# Altium project NTAG I2C plus Class4 Antenna v1.PrjPcb
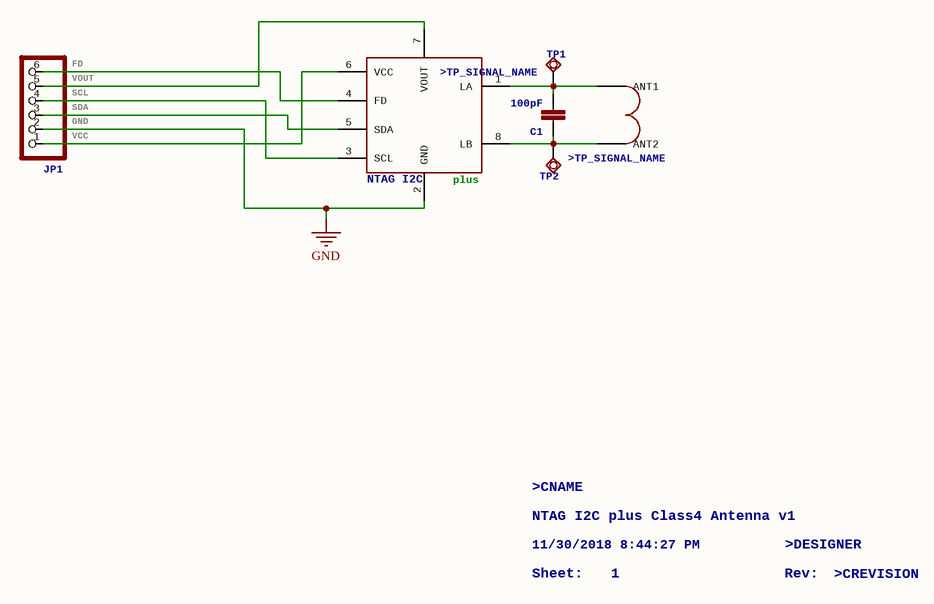
[diagram p0: NTAG I2C plus Class4 Antenna v1.SchDoc]
1 sheet, 6 parts. Net scope: global (net labels, ports and power ports of the same name join across sheets).
Board file: NTAG I2C plus Class4 Antenna v1.PcbDoc

## Sheet NTAG I2C plus Class4 Antenna v1.SchDoc: NTAG I2C plus Class4 Antenna v1
size 302 x 231 mm; Date: 11/30/2018 8:44:27 PM; SheetNumber: 1; CNAME: >CNAME; DESIGNER: >DESIGNER; CREVISION: >CREVISION; GateName_1: G$1; SymbolName_1: FR-A4L; LibraryName: SparkFun-Aesthetics; DeviceSetName: FRAME-A4L

### Parts
C1  100pF  [C0402K]
JP1  PINHD-1X6/90  [1X06/90]  (value not drawn)
TP1  TP_SIGNAL_NAME: >TP_SIGNAL_NAME  [P1-13]  (hidden comment: TPSQPAD1-13)
TP2  TP_SIGNAL_NAME: >TP_SIGNAL_NAME  [P1-13]  (hidden comment: TPSQPAD1-13)
U$1  ENERGY-HARVESTING_3-TURNS54X27_3TURN_THIN  [54X27_3TURNS_THIN]  (value not drawn)
U$3  NTAGI2C: NTAG I2C  [SOT902-3]  (hidden comment: NTAG_I2CXQFN8)

### Nets
GND: JP1.2 U$3.2(GND)
NetC1_1: C1.1 TP2.TP U$1.ANT2 U$3.8(LB)
NetC1_2: C1.2 TP1.TP U$1.ANT1 U$3.1(LA)
NetJP1_1: JP1.1 U$3.6(VCC)
NetJP1_3: JP1.3 U$3.5(SDA)
NetJP1_4: JP1.4 U$3.3(SCL)
NetJP1_5: JP1.5 U$3.7(VOUT)
NetJP1_6: JP1.6 U$3.4(FD)

### Notes on the sheet
- (near JP1) FD
- (near JP1) VOUT
- (near JP1) SCL
- (near JP1) SDA
- (near JP1) GND
- (near JP1) VCC
- (near U$3) plus
- NTAG I2C plus Class4 Antenna v1
- >CNAME
- 11/30/2018 8:44:27 PM
- Sheet:
- 1
- Rev:
- >DESIGNER
- >CREVISION
- 2
- 3
- 4
- 5
- 6
- 7
- 8
- A
- B
- C
- D
- E

### Library data of the parts
C1 = C-EUC0402K: CAPACITOR, European symbol; GateName_1: G$1; SymbolName_1: C-EU; DeviceName: C0402K; LibraryName: rcl; DeviceSetName: C-EU
JP1 = PINHD-1X6/90: PIN HEADER; GateName_1: A; SymbolName_1: PINHD6; DeviceName: /90; LibraryName: pinhead (2); DeviceSetName: PINHD-1X6
TP1 TP2 = TPSQPAD1-13: Test pad; GateName_1: G$1; SymbolName_1: PPAD; DeviceSetName: TPSQ; DeviceName: PAD1-13; LibraryName: testpad
U$1 = ENERGY-HARVESTING_3-TURNS54X27_3TURN_THIN: GateName_1: G$1; SymbolName_1: L_ENERGY-HARV.; DeviceName: 54X27_3TURN_THIN; LibraryName: NTAG_Antennas; DeviceSetName: ENERGY-HARVESTING_3-TURNS
U$3 = NTAG_I2CXQFN8: GateName_1: G$1; DeviceName: XQFN8; SymbolName_1: NTAG_I2C; LibraryName: NTAG_I2C; DeviceSetName: NTAG_I2C